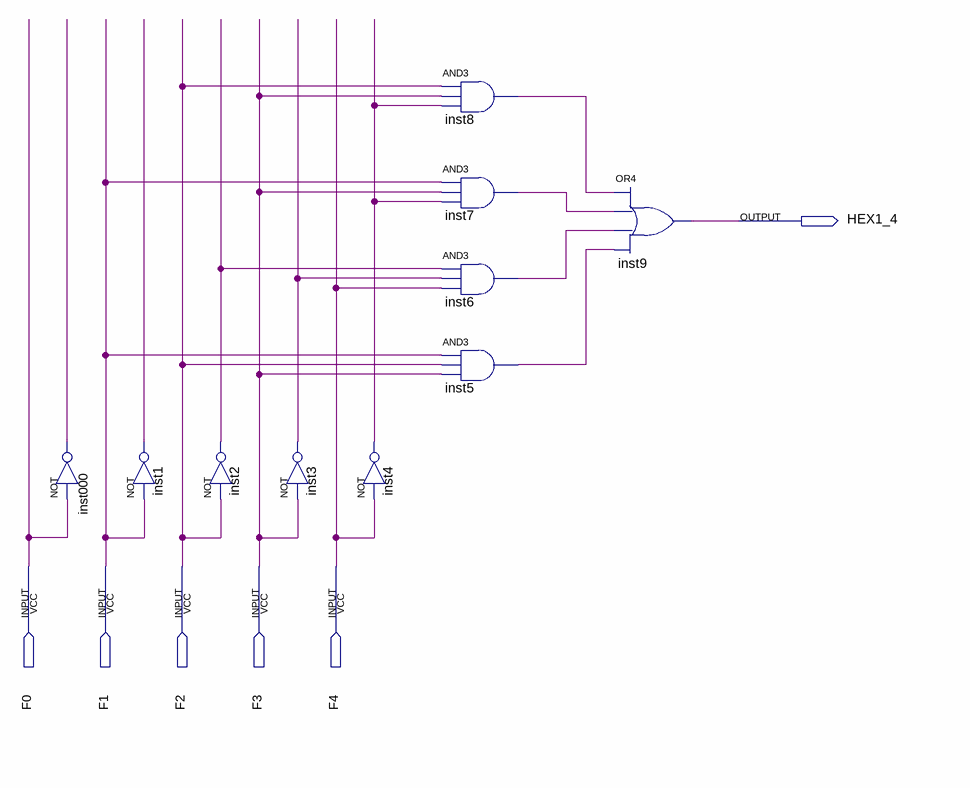
[diagram p0: schematic sheet]
// Quartus schematic HEX14.bdf as structural Verilog: 10 symbols, 6 pins
module HEX14 (
  input  F0,
  input  F1,
  input  F2,
  input  F3,
  input  F4,
  output HEX1_4
);

  wire inst000_out, inst1_out, inst2_out, inst3_out, inst4_out, inst5_out, inst6_out, inst7_out, inst8_out;

  not inst000 (inst000_out, F0);
  not inst1 (inst1_out, F1);
  not inst2 (inst2_out, F2);
  not inst3 (inst3_out, F3);
  not inst4 (inst4_out, F4);
  and inst8 (inst8_out, F2, F3, inst4_out);
  and inst7 (inst7_out, F1, F3, inst4_out);
  and inst6 (inst6_out, inst2_out, inst3_out, F4);
  and inst5 (inst5_out, F1, F2, F3);
  or inst9 (HEX1_4, inst8_out, inst7_out, inst6_out, inst5_out);
endmodule
